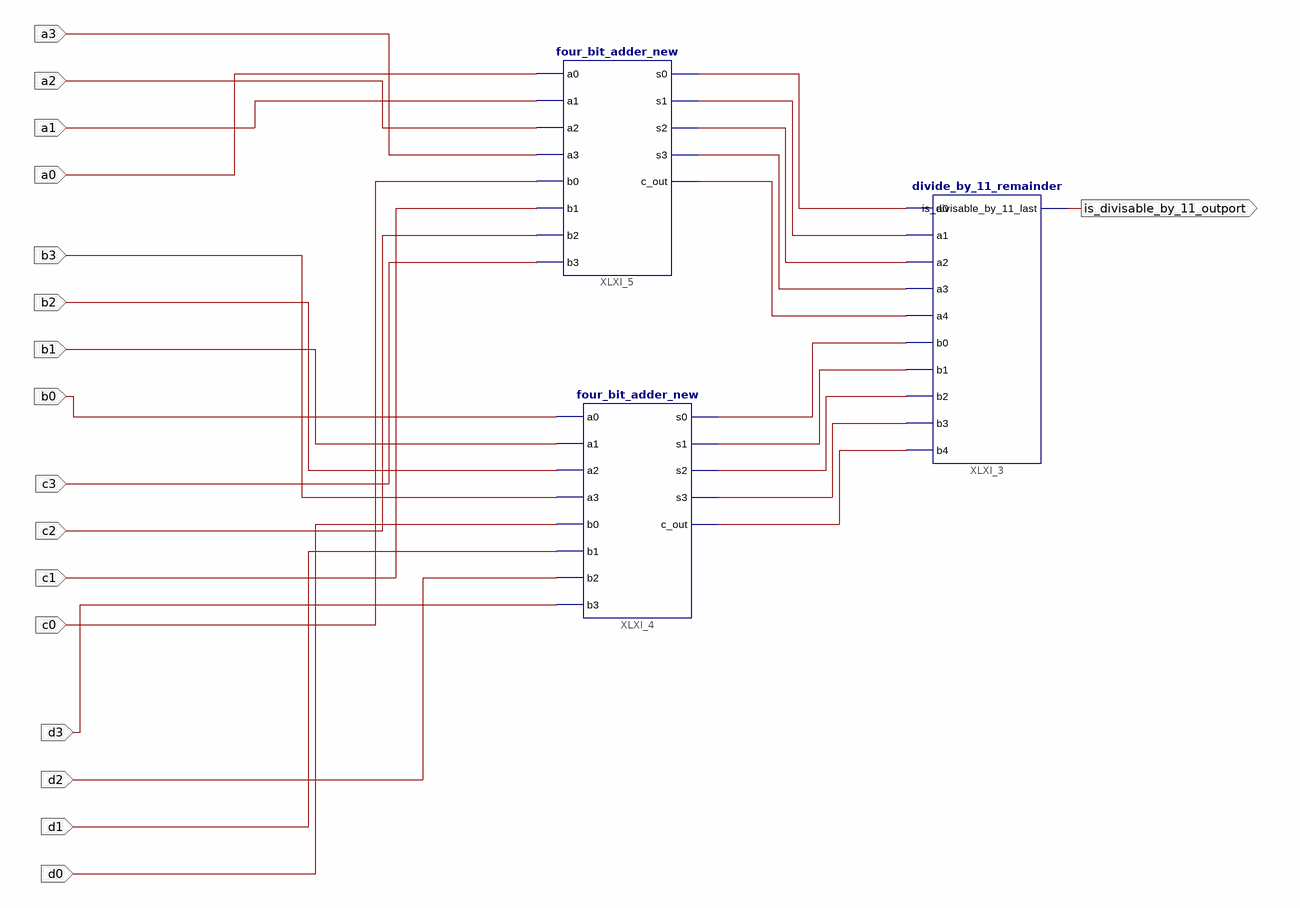
[diagram p0: schematic sheet 1]
// Xilinx ISE schematic check_for_11.sch (spartan3adsp) as structural Verilog: 3 symbols, 17 ports
module check_for_11 (
  input  a1,
  input  a3,
  input  a2,
  input  a0,
  input  b1,
  input  b3,
  input  b2,
  input  b0,
  input  c1,
  input  c3,
  input  c2,
  input  c0,
  input  d1,
  input  d3,
  input  d2,
  input  d0,
  output is_divisable_by_11_outport
);

  wire XLXN_12, XLXN_13, XLXN_14, XLXN_15, XLXN_16, XLXN_17, XLXN_18, XLXN_19, XLXN_20, XLXN_21;

  divide_by_11_remainder XLXI_3 (
    .a0(XLXN_12), .a1(XLXN_13), .a2(XLXN_14), .a3(XLXN_15), .a4(XLXN_16), .b0(XLXN_17), .b1(XLXN_18),
    .b2(XLXN_19), .b3(XLXN_20), .b4(XLXN_21), .is_divisable_by_11_last(is_divisable_by_11_outport));
  four_bit_adder_new XLXI_4 (
    .a0(b0), .a1(b1), .a2(b2), .a3(b3), .b0(d0), .b1(d1), .b2(d2), .b3(d3), .c_out(XLXN_21), .s0(XLXN_17),
    .s1(XLXN_18), .s2(XLXN_19), .s3(XLXN_20));
  four_bit_adder_new XLXI_5 (
    .a0(a0), .a1(a1), .a2(a2), .a3(a3), .b0(c0), .b1(c1), .b2(c2), .b3(c3), .c_out(XLXN_16), .s0(XLXN_12),
    .s1(XLXN_13), .s2(XLXN_14), .s3(XLXN_15));
endmodule
